# Altium schematic sheet Printer.SchDoc
size A4
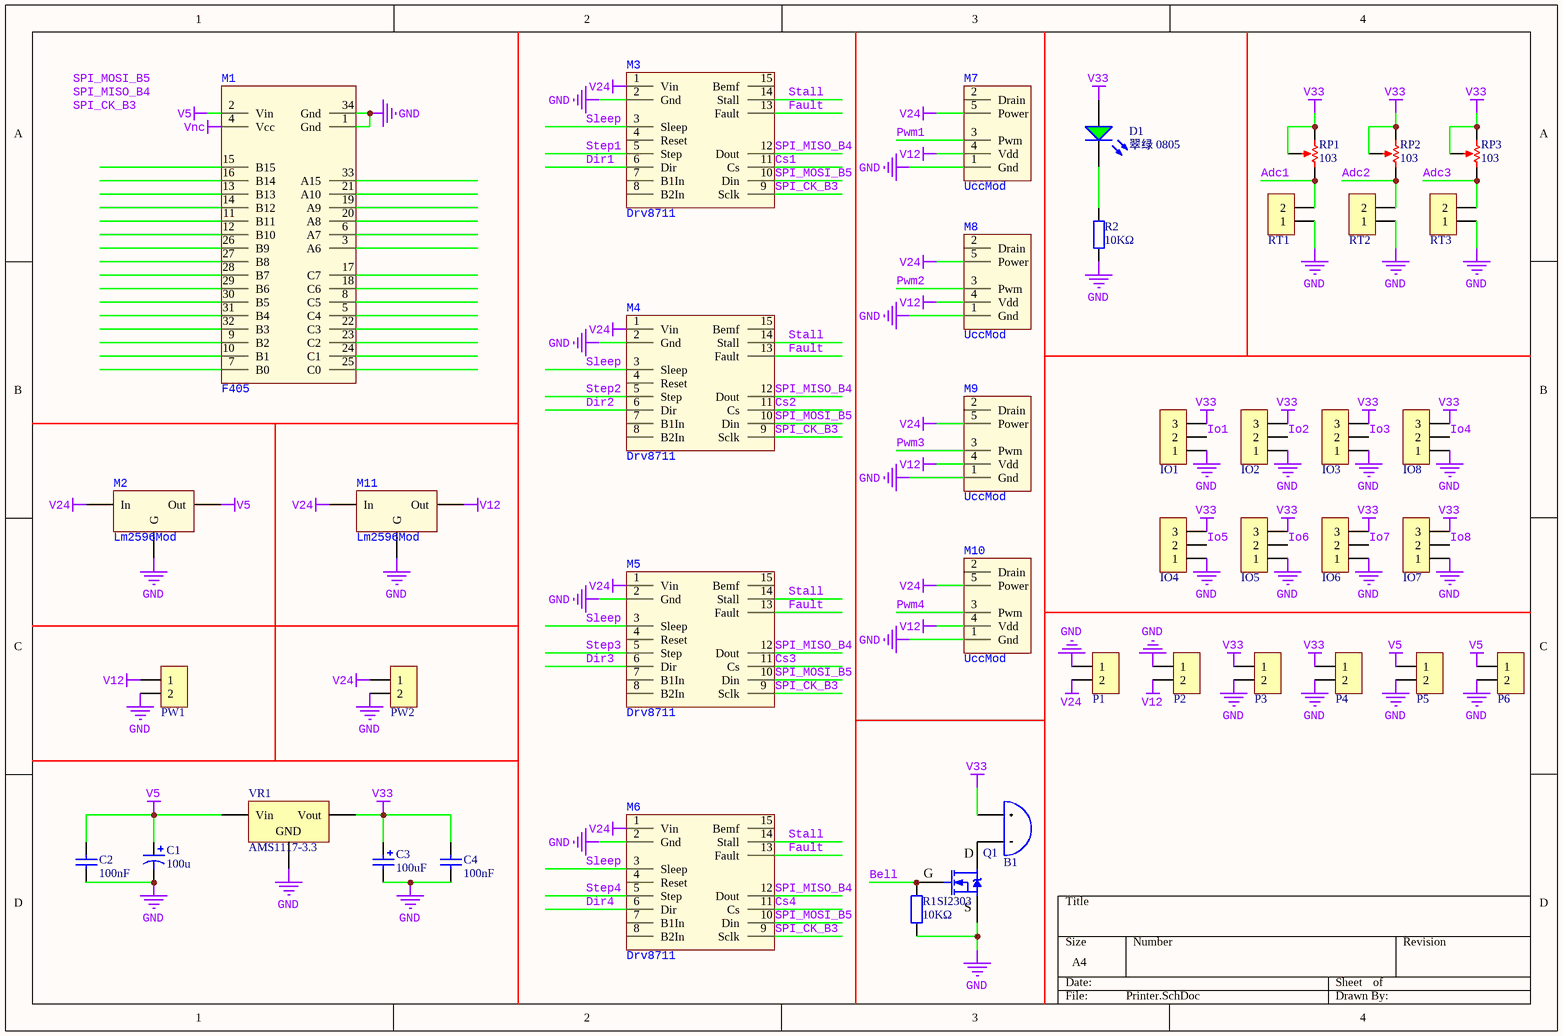
[diagram p0: Printer.SchDoc]

## Parts
B1  Bell  [BELL11.9]  (value not drawn)
C1  100u  [CM D(6.3*7.7)]
C2  100nF  [0805_C]
C3  100uF  [CASE-B_3528]
C4  100nF  [0805_C]
D1  翠绿 0805  [0805_LED_S1]
IO1  HDR-1X3  [XH2.54-LI-3P]  (value not drawn)
IO2  HDR-1X3  [XH2.54-LI-3P]  (value not drawn)
IO3  HDR-1X3  [XH2.54-LI-3P]  (value not drawn)
IO4  HDR-1X3  [XH2.54-LI-3P]  (value not drawn)
IO5  HDR-1X3  [XH2.54-LI-3P]  (value not drawn)
IO6  HDR-1X3  [XH2.54-LI-3P]  (value not drawn)
IO7  HDR-1X3  [XH2.54-LI-3P]  (value not drawn)
IO8  HDR-1X3  [XH2.54-LI-3P]  (value not drawn)
M1  F405  [F405R]
M2  Lm2596Mod  [DcDc]
M3  Drv8711  [Drv8711Mod]
M4  Drv8711  [Drv8711Mod]
M5  Drv8711  [Drv8711Mod]
M6  Drv8711  [Drv8711Mod]
M7  UccMod  [UccMod]
M8  UccMod  [UccMod]
M9  UccMod  [UccMod]
M10  UccMod  [UccMod]
M11  Lm2596Mod  [DcDc]
P1  HDR-1X2  [XH2.54-LI-2P]  (value not drawn)
P2  HDR-1X2  [XH2.54-LI-2P]  (value not drawn)
P3  HDR-1X2  [XH2.54-LI-2P]  (value not drawn)
P4  HDR-1X2  [XH2.54-LI-2P]  (value not drawn)
P5  HDR-1X2  [XH2.54-LI-2P]  (value not drawn)
P6  HDR-1X2  [XH2.54-LI-2P]  (value not drawn)
PW1  HDR-1X2  [2PIN-5.08A]  (value not drawn)
PW2  HDR-1X2  [2PIN-5.08A]  (value not drawn)
Q1  SI2303  [SI2302]
R1  10KΩ  [0805_R]
R2  10KΩ  [0805_R]
RP1  103  [RP3362P]
RP2  103  [RP3362P]
RP3  103  [RP3362P]
RT1  HDR-1X2  [XH2.54-LI-2P]  (value not drawn)
RT2  HDR-1X2  [XH2.54-LI-2P]  (value not drawn)
RT3  HDR-1X2  [XH2.54-LI-2P]  (value not drawn)
VR1  AMS1117-3.3  [SOT-223]

## Nets
GND: C1.2 C2.1 C3.2 C4.1 IO1.1 IO2.1 IO3.1 IO4.1 IO5.1 IO6.1 IO7.1 IO8.1 M1.1(Gnd) M1.34(Gnd) M2.2(G) M3.2(Gnd) M4.2(Gnd) M5.2(Gnd) M6.2(Gnd) M7.1(Gnd) M8.1(Gnd) M9.1(Gnd) M10.1(Gnd) M11.2(G) P1.1 P2.1 P3.2 P4.2 P5.2 P6.2 PW1.2 PW2.2 Q1.3(S) R1.1 R2.1 RT1.1 RT2.1 RT3.1 VR1.1(GND)
V5: C1.1 C2.2 M1.2(Vin) M2.1(Out) P5.1 P6.1 VR1.3(Vin)
V12: M7.4(Vdd) M8.4(Vdd) M9.4(Vdd) M10.4(Vdd) M11.1(Out) P2.2 PW1.1
V24: M2.3(In) M3.1(Vin) M4.1(Vin) M5.1(Vin) M6.1(Vin) M7.5(Power) M8.5(Power) M9.5(Power) M10.5(Power) M11.3(In) P1.2 PW2.1
V33: B1.1(A) C3.1 C4.2 D1.A IO1.3 IO2.3 IO3.3 IO4.3 IO5.3 IO6.3 IO7.3 IO8.3 P3.1 P4.1 RP1.2(TAP) RP1.3(TOP) RP2.2(TAP) RP2.3(TOP) RP3.2(TAP) RP3.3(TOP) VR1.2(Vout)
Vnc: M1.4(Vcc)
Adc1: RP1.1(BOT) RT1.2
Adc2: RP2.1(BOT) RT2.2
Adc3: RP3.1(BOT) RT3.2
Bell: Q1.1(G) R1.2
Cs1: M3.11(Cs)
Cs2: M4.11(Cs)
Cs3: M5.11(Cs)
Cs4: M6.11(Cs)
Dir1: M3.6(Dir)
Dir2: M4.6(Dir)
Dir3: M5.6(Dir)
Dir4: M6.6(Dir)
Fault: M3.13(Fault) M4.13(Fault) M5.13(Fault) M6.13(Fault)
Io1: IO1.2
Io2: IO2.2
Io3: IO3.2
Io4: IO8.2
Io5: IO4.2
Io6: IO5.2
Io7: IO6.2
Io8: IO7.2
Pwm1: M7.3(Pwm)
Pwm2: M8.3(Pwm)
Pwm3: M9.3(Pwm)
Pwm4: M10.3(Pwm)
Sleep: M3.3(Sleep) M4.3(Sleep) M5.3(Sleep) M6.3(Sleep)
SPI_CK_B3: M3.9(Sclk) M4.9(Sclk) M5.9(Sclk) M6.9(Sclk)
SPI_MISO_B4: M3.12(Dout) M4.12(Dout) M5.12(Dout) M6.12(Dout)
SPI_MOSI_B5: M3.10(Din) M4.10(Din) M5.10(Din) M6.10(Din)
Stall: M3.14(Stall) M4.14(Stall) M5.14(Stall) M6.14(Stall)
Step1: M3.5(Step)
Step2: M4.5(Step)
Step3: M5.5(Step)
Step4: M6.5(Step)
NetB1_2: B1.2(B) Q1.2(D)
NetD1_K: D1.K R2.2

Not connected (* = marked no-connect by the designer): M1 3(A6) 5(C4) 6(A7) 7(B0) 8(C5) 9(B2) 10(B1) 11(B11) 12(B10) 13(B13) 14(B12) 15(B15) 16(B14) 17(C7) 18(C6) 19(A9) 20(A8) 21(A10) 22(C3) 23(C2) 24(C1) 25(C0) 26(B9) 27(B8) 28(B7) 29(B6) 30(B5) 31(B4) 32(B3) 33(A15); M3 4(Reset) 7(B1In) 8(B2In) 15(Bemf); M4 4(Reset) 7(B1In) 8(B2In) 15(Bemf); M5 4(Reset) 7(B1In) 8(B2In) 15(Bemf); M6 4(Reset) 7(B1In) 8(B2In) 15(Bemf); M7 2(Drain); M8 2(Drain); M9 2(Drain); M10 2(Drain)

## Notes on the sheet
- Labels drawn without touching a wire or pin: SPI_CK_B3, SPI_MISO_B4, SPI_MOSI_B5

## Library data of the parts
B1 = Bell: 蜂鸣器
C1 = Cp: Polarized Capacitor (Axial); Published: 8-Jun-2000; LatestRevisionDate: 17-Jul-2002; LatestRevisionNote: Re-released for DXP Platform.; PackageReference: POLAR0.8; Publisher: Altium Limited; PackageDescription: Polarized Capacitor; 2 Leads
C2 C4 = 0805 100nF(104) 10% 50V: 贴片电容; ComponentLink1Description: 供应商链接; ComponentLink1URL: http://www.szlcsc.com/product/details_50686.html; Package: 0805; Supplier: LC; SuppliersPartNumber: C49678
C3 = 3528 100uF (107) 10% 6.3V: 钽电容; ComponentLink1Description: 供应商链接; ComponentLink1URL: http://www.szlcsc.com/product/details_16815.html; Package: 3528; Supplier: LC; SuppliersPartNumber: C16133
D1 = 0805 翠绿: 发光二极管; ComponentLink1Description: 供应商链接; ComponentLink1URL: http://www.szlcsc.com/product/details_2670.html; Package: 0805; Supplier: LC; SuppliersPartNumber: C2297
IO1-IO8 = Header 3: 3P接插件; 版权归属: 源创客; BOM名称: 3P接插件; 学习资源: www.ooocke.com
M1 = F405R
M2 M11 = DcDc
M3-M6 = Drv8711Mod
P1-P6 PW1 PW2 RT1-RT3 = Header 2: 2P接插件; 版权归属: 源创客; BOM名称: 2P接插件; 学习资源: www.ooocke.com
Q1 = NMOS: N沟场效应管; 版权归属: 源创客; BOM名称: N沟场效应管; 学习资源: www.ooocke.com
R1 R2 = 0805 10KΩ (1002) 1%: 贴片电阻; ComponentLink1Description: 供应商链接; ComponentLink1URL: http://www.szlcsc.com/product/details_18102.html; Package: 0805; Supplier: LC; SuppliersPartNumber: C17414
RP1-RP3 = Rp: Potentiometer; Sim Note: Enter the Resistance value and the set point into parameter fields.; Set Position: 0.5; Published: 8-Jun-2000; LatestRevisionDate: 17-Jul-2002; LatestRevisionNote: Re-released for DXP Platform.; PackageReference: VR5; Publisher: Altium Limited; PackageDescription: Variable Resistor, Thru-Hole; 3 Leads
VR1 = SOT-223 AMS1117-3.3: 低压差线性稳压(LDO); ComponentLink1Description: 供应商链接; ComponentLink1URL: http://www.szlcsc.com/product/details_6652.html; Package: SOT-223; Supplier: LC; SuppliersPartNumber: C6186